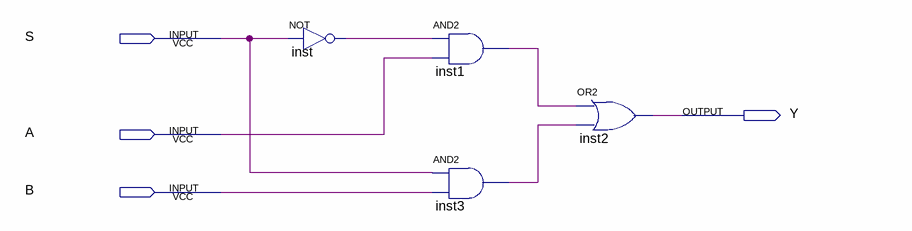
[diagram p0: schematic sheet]
// Quartus schematic mux2-1.bdf as structural Verilog: 4 symbols, 4 pins
module \mux2-1  (
  input  S,
  input  A,
  input  B,
  output Y
);

  wire inst1_out, inst3_out, inst_out;

  not inst (inst_out, S);
  and inst1 (inst1_out, inst_out, A);
  and inst3 (inst3_out, S, B);
  or inst2 (Y, inst1_out, inst3_out);
endmodule
